# Altium schematic sheet MCU.SchDoc
size A4; SheetNumber: 2; SheetTotal: 3
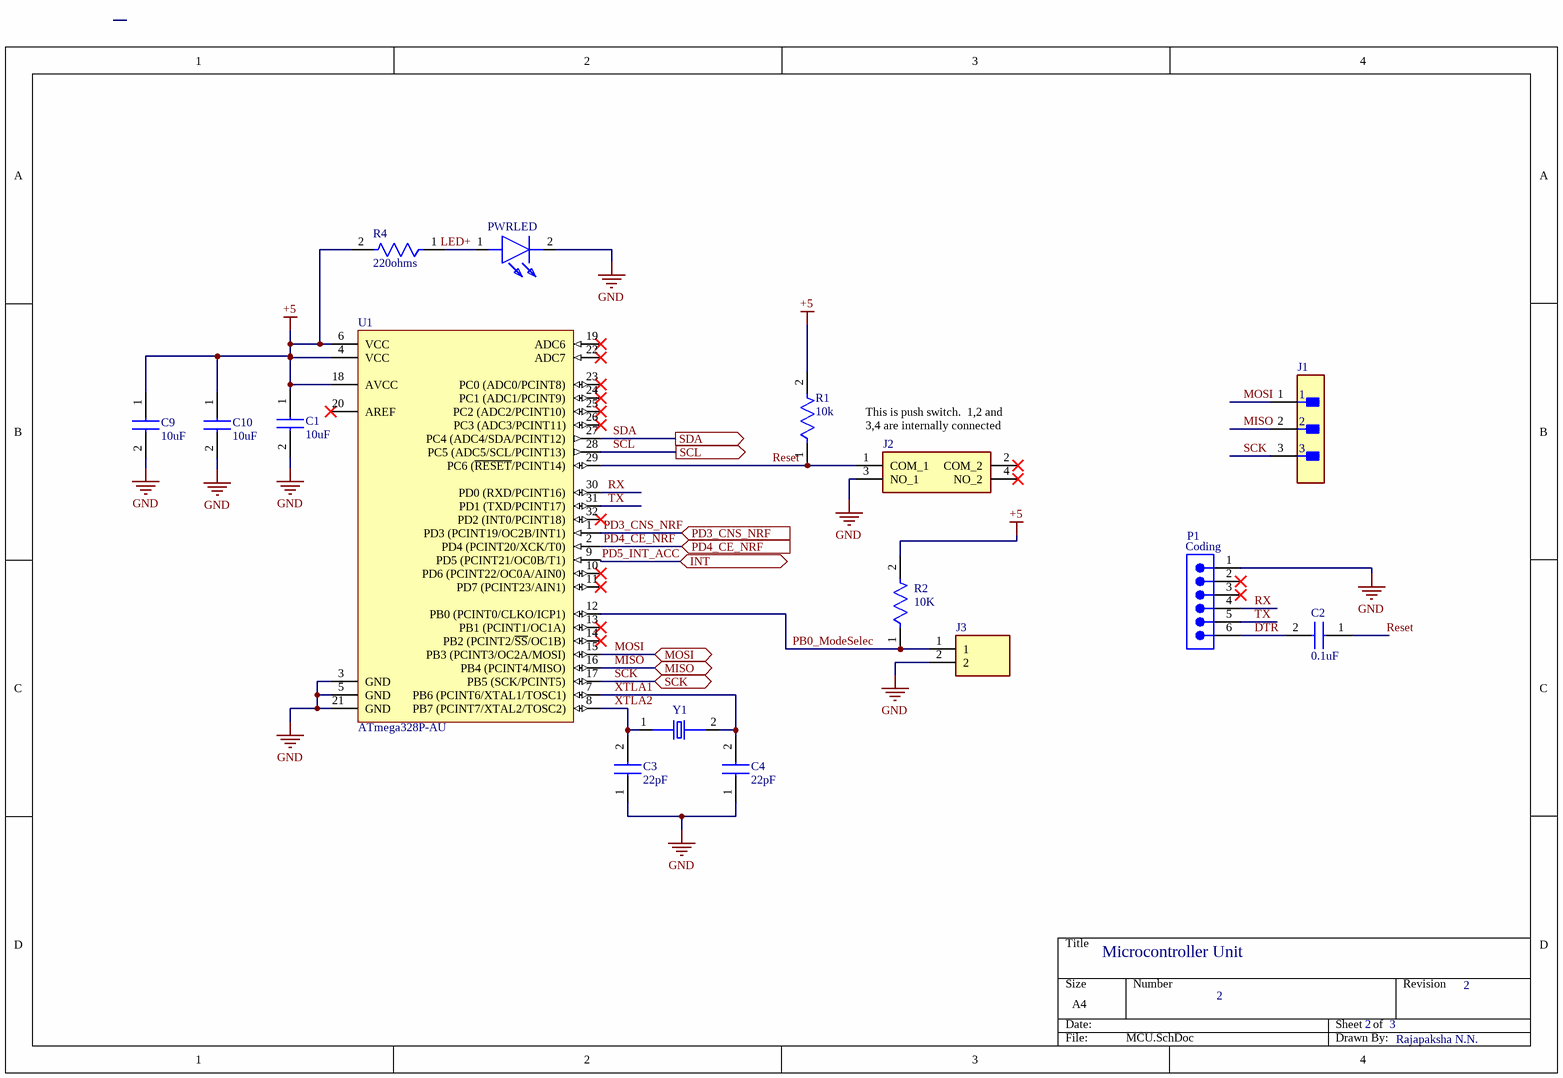
[diagram p0: MCU.SchDoc]

## Parts
C1  10uF  [CAPC3216X180N]
C2  value 0.1uF  [C0805]  (hidden comment: C0805R104J5RACTU)
C3  value 22pF  [C0805]  (hidden comment: C0805C220F1HACTU)
C4  value 22pF  [C0805]  (hidden comment: C0805C220F1HACTU)
C9  10uF  [CAPC3216X180N]
C10  10uF  [CAPC3216X180N]
J1  87224-3  [FP-87224-3-MFG]  (value not drawn)
J2  8-1437565-1  [814375651]  (value not drawn)
J3  1727010  [1727010]  (value not drawn)
P1  value Coding  [SMTC-TSW-106-07-X-S]  (hidden comment: TSW-106-07-L-S)
PWRLED  598-2105-107F  [5982105107F]  (value not drawn)
R1  10k  [FP-RK73H2A-IPC_C]
R2  10k  [FP-RK73H2A-IPC_C]
R4  220ohms  [FP-RK73H2A-IPC_C]
U1  ATmega328P-AU  [32A_M]
Y1  FOXSDLF/160-20  [XTAL_FOXSDLF/160-20]  (value not drawn)

## Ports
INT (bidir, see top-level[3B]), MISO (bidir, see top-level[3B]), MOSI (bidir, see top-level[3B]), PD3_CNS_NRF (in, see top-level[3B]), PD4_CE_NRF (in, see top-level[3B]), SCK (bidir, see top-level[3B]), SCL (out, see top-level[3B]), SDA (out, see top-level[3B])

## Nets
+5: C1.1 C9.1 C10.1 R1.2 R2.2 R4.2 U1.4(VCC) U1.6(VCC) U1.18(AVCC)
GND: C1.2 C3.1 C4.1 C9.2 C10.2 J2.3(NO_1) J3.2 P1.1 PWRLED.2(K) U1.3(GND) U1.5(GND) U1.21(GND)
DTR: C2.2 P1.6
MISO: J1.2 U1.16(PB4_(PCINT4/MISO)) ; port MISO
MOSI: J1.1 U1.15(PB3_(PCINT3/OC2A/MOSI)) ; port MOSI
PB0_ModeSelec: J3.1 R2.1 U1.12(PB0_(PCINT0/CLKO/ICP1))
PD3_CNS_NRF: U1.1(PD3_(PCINT19/OC2B/INT1)) ; port PD3_CNS_NRF
PD4_CE_NRF: U1.2(PD4_(PCINT20/XCK/T0)) ; port PD4_CE_NRF
PD5_INT_ACC: U1.9(PD5_(PCINT21/OC0B/T1)) ; port INT
Reset: C2.1 J2.1(COM_1) R1.1 U1.29(PC6_(~{RESET}/PCINT14))
RX: P1.4 U1.30(PD0_(RXD/PCINT16))
SCK: J1.3 U1.17(PB5_(SCK/PCINT5)) ; port SCK
SCL: U1.28(PC5_(ADC5/SCL/PCINT13)) ; port SCL
SDA: U1.27(PC4_(ADC4/SDA/PCINT12)) ; port SDA
TX: P1.5 U1.31(PD1_(TXD/PCINT17))
XTLA1: C4.2 U1.7(PB6_(PCINT6/XTAL1/TOSC1)) Y1.2
XTLA2: C3.2 U1.8(PB7_(PCINT7/XTAL2/TOSC2)) Y1.1
NetPWRLED_1: PWRLED.1(A) R4.1

Not connected (* = marked no-connect by the designer): J2 2(COM_2)* 4(NO_2)*; P1 2* 3*; U1 10(PD6_(PCINT22/OC0A/AIN0))* 11(PD7_(PCINT23/AIN1))* 13(PB1_(PCINT1/OC1A))* 14(PB2_(PCINT2/~{SS}/OC1B))* 19(ADC6)* 20(AREF)* 22(ADC7)* 23(PC0_(ADC0/PCINT8))* 24(PC1_(ADC1/PCINT9))* 25(PC2_(ADC2/PCINT10))* 26(PC3_(ADC3/PCINT11))* 32(PD2_(INT0/PCINT18))*

## Notes on the sheet
- (near J2) This is push switch.  1,2 and 3,4 are internally connected
- Microcontroller Unit
- 2
- 3
- Rajapaksha N.N.
- Labels drawn without touching a wire or pin: LED+

## Library data of the parts
C1 C9 C10 = GRT31CR71E106KE13L: Capacitor; Manufacturer_Name: Murata Electronics; Datasheet Link: https://psearch.en.murata.com/capacitor/product/GRT31CR71E106KE13%23.html; Height: 1.8mm; Manufacturer_Part_Number: GRT31CR71E106KE13L; Mouser Part Number: 81-GRT31CR71E106KE3L; Mouser Price/Stock: https://www.mouser.co.uk/ProductDetail/Murata-Electronics/GRT31CR71E106KE13L?qs=qkDYIeTQ%252BEltpBe08x6bHQ%3D%3D
C2 = C0805R104J5RACTU: Capacitor; Manufacturer_Name: KEMET; Datasheet Link: https://content.kemet.com/datasheets/KEM_C1075_X7R_HT_SMD.pdf; Height: 1.1mm; Manufacturer_Part_Number: C0805R104J5RACTU; Mouser Part Number: 80-C0805R104J5RACTU; Mouser Price/Stock: https://www.mouser.co.uk/ProductDetail/KEMET/C0805R104J5RACTU?qs=RcG8xmE7yp2JeihV4l474Q%3D%3D
C3 C4 = C0805C220F1HACTU: Capacitor; Manufacturer_Name: KEMET; Datasheet Link: https://content.kemet.com/datasheets/KEM_C1007_X8R_ULTRA_150C_SMD.pdf; Height: 1.1mm; Manufacturer_Part_Number: C0805C220F1HACTU; Mouser Part Number: 80-C0805C220F1HACTU; Mouser Price/Stock: https://www.mouser.co.uk/ProductDetail/KEMET/C0805C220F1HACTU?qs=W0yvOO0ixfE4AlEZ2t4a8A%3D%3D
J1 = CMP-2000-05697-2: CONN HEADER VERT 3POS 2.54MM; Number of Positions: 3; Gasket: No (Without); High Speed Serial Data Connector: No; Current Rating: 3A; Contact Post Length: 0.125inch; PCB Thickness: 1.397mm; PCB Mount Retention: Without; Connector Type: Plug; Approvals: CSA; PCB Mounting Orientation: Vertical; Pitch: 2.54mm; Mating Alignment: No (Without); Housing Color: Black; Contact Gender: Male; Length: 7.21mm; Max Operating Temperature: 105°C; Strain Relief: No (Without); Contact Material: Bronze; Row Spacing: 2.54mm; Series: AMPMODU MOD II; Board Standoff: No (Without); Package Quantity: 520; Radiation Hardening: No; Contact Protection: No (Without); Stabilizers: No (Without); Number of Rows: 1; Contact Mating Length: 8.08mm; Contact Shape: Square; Depth: 2.54mm; Contact Current Rating: 3A; Flammability Rating: UL94 V-0; Packaging: Carton; Number of Contacts: 3; Orientation: Straight; Mount: Through Hole; Keyed: No; Contact Type: Male Pin; Housing Material: Thermoplastic; High Temperature Housing: No; ELV: Compliant; Contact Plating: Gold; Termination: Through Hole; Selectively Loaded: No (Without); Lead Free: Lead Free; Min Operating Temperature: -65°C; Mating Connector Lock: No (Without); Color: Black; RoHS Compliant: Yes
J2 = 8-1437565-1: Connector; Manufacturer_Name: TE Connectivity; Datasheet Link: https://www.te.com/commerce/DocumentDelivery/DDEController?Action=srchrtrv&DocNm=1654270-2&DocType=Catalog%20Section&DocLang=English&PartCntxt=8-1437565-1&DocFormat=pdf; Height: 1.7mm; Manufacturer_Part_Number: 8-1437565-1; Mouser Part Number: 506-8-1437565-1; Mouser Price/Stock: https://www.mouser.co.uk/ProductDetail/TE-Connectivity-PB/8-1437565-1?qs=%2FwXgF%2FfIho85SUhcdHoonw%3D%3D; Arrow Part Number: 8-1437565-1; Arrow Price/Stock: https://www.arrow.com/en/products/8-1437565-1/te-connectivity?region=europe
J3 = 1727010: Connector; Manufacturer_Name: Phoenix Contact; Datasheet Link: https://datasheet.datasheetarchive.com/originals/distributors/SFDatasheet-2/sf-00050638.pdf; Height: 8.65mm; Manufacturer_Part_Number: 1727010; Mouser Part Number: 651-1727010; Mouser Price/Stock: https://www.mouser.co.uk/ProductDetail/Phoenix-Contact/1727010?qs=JcjeNNoqGSMjtHhQoBJ7UA%3D%3D; Arrow Part Number: 1727010; Arrow Price/Stock: https://www.arrow.com/en/products/1727010/phoenix-contact?region=nac
P1 = CMP-1024-00386-1: 0.025" SQ Post Header, Through-hole, Vertical, -55 to 125 degC, 2.54 mm Pitch, 6-Pin, Male, RoHS; Manufacturer: Samtec; Pitch: 2.54 mm; RoHS: True; PartNumber: TSW-106-07-L-S; Orientation: Vertical; PackageReference: TSW-106-07-X-S; PackageDescription: .025[0.64] SQ. Post Terminal Strip Assembly; DatasheetVersion: F-214; ComponentLink3Description: Package Specification; Mounting Technology: Through-hole; ComponentLink2Description: Datasheet; PackageVersion: DM, 8/1988; ComponentLink3URL: http://www.samtec.com/documents/webfiles/cpdf/TSW-XXX-XX-XXX-X-XX-XXX-MKT.pdf; Temperature Range: -55 to 125 degC; ComponentLink2URL: http://www.samtec.com/documents/webfiles/pdf/TSW_TH.PDF; ComponentLink1Description: Manufacturer URL; ComponentLink1URL: http://www.samtec.com
PWRLED = 598-2105-107F: LED; Manufacturer_Name: Dialight; Datasheet Link: https://s3-us-west-2.amazonaws.com/catsy.557/C18686.pdf; Height: 0.8128mm; Manufacturer_Part_Number: 598-2105-107F; Mouser Part Number: 645-598-2105-107F; Mouser Price/Stock: https://www.mouser.co.uk/ProductDetail/Dialight/598-2105-107F?qs=17ckDYBRdemC3ww5qaaOiA%3D%3D
R1 R2 R4 = CMP-04015-088604-1: 10kΩ ±1% 0.25W Chip Resistor 0805 Thick Film AEC-Q200 Qualified; Resistance: 10kR; Voltage Rating: 150V; Temperature Coefficient: 100ppm/°C; Power Rating: 125mW; Packaging: Tape and Reel; Case Code (Imperial): 0805; Min Operating Temperature: -55°C; Height: 0.5mm; Construction: Rectangular; Tolerance: 1%; Termination: SMD/SMT; Case Code (Metric): 2012; Max Operating Temperature: 155°C; Package Quantity: 10000; RoHS Compliant: Yes; Lead Free: Lead Free; Series: RK73H; Depth: 1.25mm; Case/Package: 0805; Length: 2mm; Width: 1.25mm; Resistor Type: Thick Film; Military Standard: Not
  R2: Value: 10K
U1 = CMP-0095-00269-2: 8-bit AVR Microcontroller, 32KB Flash, 1KB EEPROM, 2KB SRAM, 32-pin TQFP, Industrial Grade (-40°C to 85°C); PackageDescription: 32-Lead, 7x7x1.0 mm Body, 0.8mm Lead Pitch, Thin Profile Plastic Quad Flat Package (TQFP); DatasheetVersion: revD, May-2011; RevisionNote: DatasheetVersion & PackageVersion updated. URLs added.; ComponentLink1URL: http://www.atmel.com/; ComponentLink2Description: ATmega48A/48PA/88A/88PA/168A/168PA/328/328P Datasheet; Code_JEDEC: MS-026-ABA; ComponentLink1Description: Manufacturer URL; PackageReference: 32A; ComponentLink3Description: ATmega48A/48PA/88A/88PA/168A/168PA/328/328P Summary; ComponentLink2URL: http://www.atmel.com/dyn/resources/prod_documents/doc8271.pdf; PackageVersion: revC, Oct-2010; ComponentLink3URL: http://www.atmel.com/dyn/resources/prod_documents/8271S.pdf
Y1 = FOXSDLF/160-20: Microprocessor, Crystal; 16 Mhz; + 30 Ppm @ Degc; 7 Pf (Max.); 20 Pf; -20 Deg; MF: Fox Electronics; Package: HC49SD Fox Electronics; Price: None; Value: *; SnapEDA_Link: https://www.snapeda.com/parts/FOXSDLF/160-20/Fox+Electronics/view-part/?ref=snap; MP: FOXSDLF/160-20; Availability: In Stock; Check_prices: https://www.snapeda.com/parts/FOXSDLF/160-20/Fox+Electronics/view-part/?ref=eda